# EAGLE schematic CoilGunPrototype (EAGLE 9.5.1)
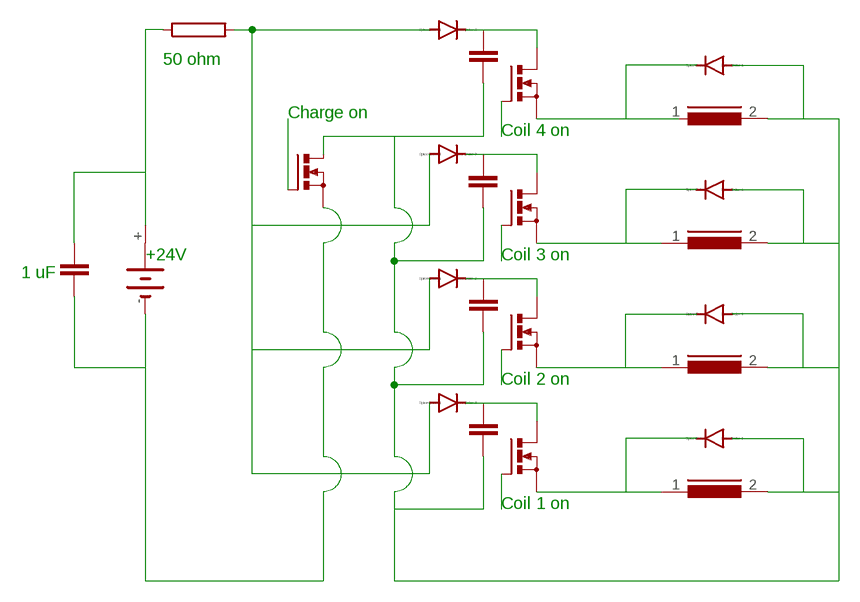
[diagram p0: schematic, sheet 1]

## Parts
C1  C10/5  [C10B5]
C2  C10/5  [C10B5]
C3  C10/5  [C10B5]
C4  C10/5  [C10B5]
C5  C10/5  [C10B5]
D3  1N4446  [DO35-10]
D4  1N4446  [DO35-10]
D5  1N4446  [DO35-10]
D6  1N4446  [DO35-10]
D7  1N4446  [DO35-10]
D8  1N4446  [DO35-10]
D9  1N4446  [DO35-10]
D10  1N4446  [DO35-10]
G1  2V60R  [2V60R]
L1  82114A  [82114A]
L2  82114A  [82114A]
L3  82114A  [82114A]
L4  82114A  [82114A]
R3  RAC05  [AC05]

## Nets
N$1: D8.C L1.1
N$2: D7.C L2.1
N$3: D9.C L3.1
N$4: D10.C L4.1
N$6: C3.1 G1.+ R3.1
N$7: C3.2 G1.-
N$8: D4.A D5.A D6.A
N$10: D4.C
N$11: C2.1 D6.C
N$12: C1.1 D5.C
N$14: C5.1 D3.C
N$17: D3.A R3.2
N$20: C1.2 C2.2 C5.2 D7.A D8.A D9.A D10.A L1.2 L2.2 L3.2 L4.2
Unconnected: C4.1 C4.2 G1.+@1(+)

## Notes on the sheet
- 50 ohm
- Charge on
- Coil 4 on
- +24V | Coil 3 on
- 1 uF
- Coil 2 on
- Coil 1 on

## Library data of the parts
C1-C5 = capacitor-wima:C: CAPACITOR naming: grid - package width
D3-D10 = diode:1N4446: DIODE high speed (Philips)
G1 = battery:2V60R: NC ACCU Varta
L1-L4 = inductors:82114A: INDUCTOR; SPICEPREFIX: L
R3 = resistor-power:R: Power Resitor; OC_FARNELL: unknown; OC_NEWARK: unknown